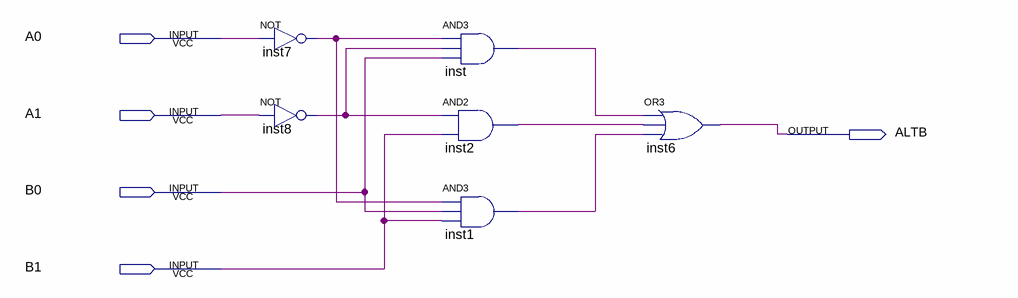
[diagram p0: schematic sheet]
// Quartus schematic ALTB.bdf as structural Verilog: 6 symbols, 5 pins
module ALTB (
  input  A0,
  input  A1,
  input  B0,
  input  B1,
  output ALTB
);

  wire inst1_out, inst2_out, inst7_out, inst8_out, inst_out;

  not inst7 (inst7_out, A0);
  not inst8 (inst8_out, A1);
  and inst (inst_out, inst7_out, inst8_out, B0);
  and inst2 (inst2_out, inst8_out, B1);
  and inst1 (inst1_out, inst7_out, B0, B1);
  or inst6 (ALTB, inst_out, inst2_out, inst1_out);
endmodule
